# Altium project F4_PCB_Project.PrjPcb
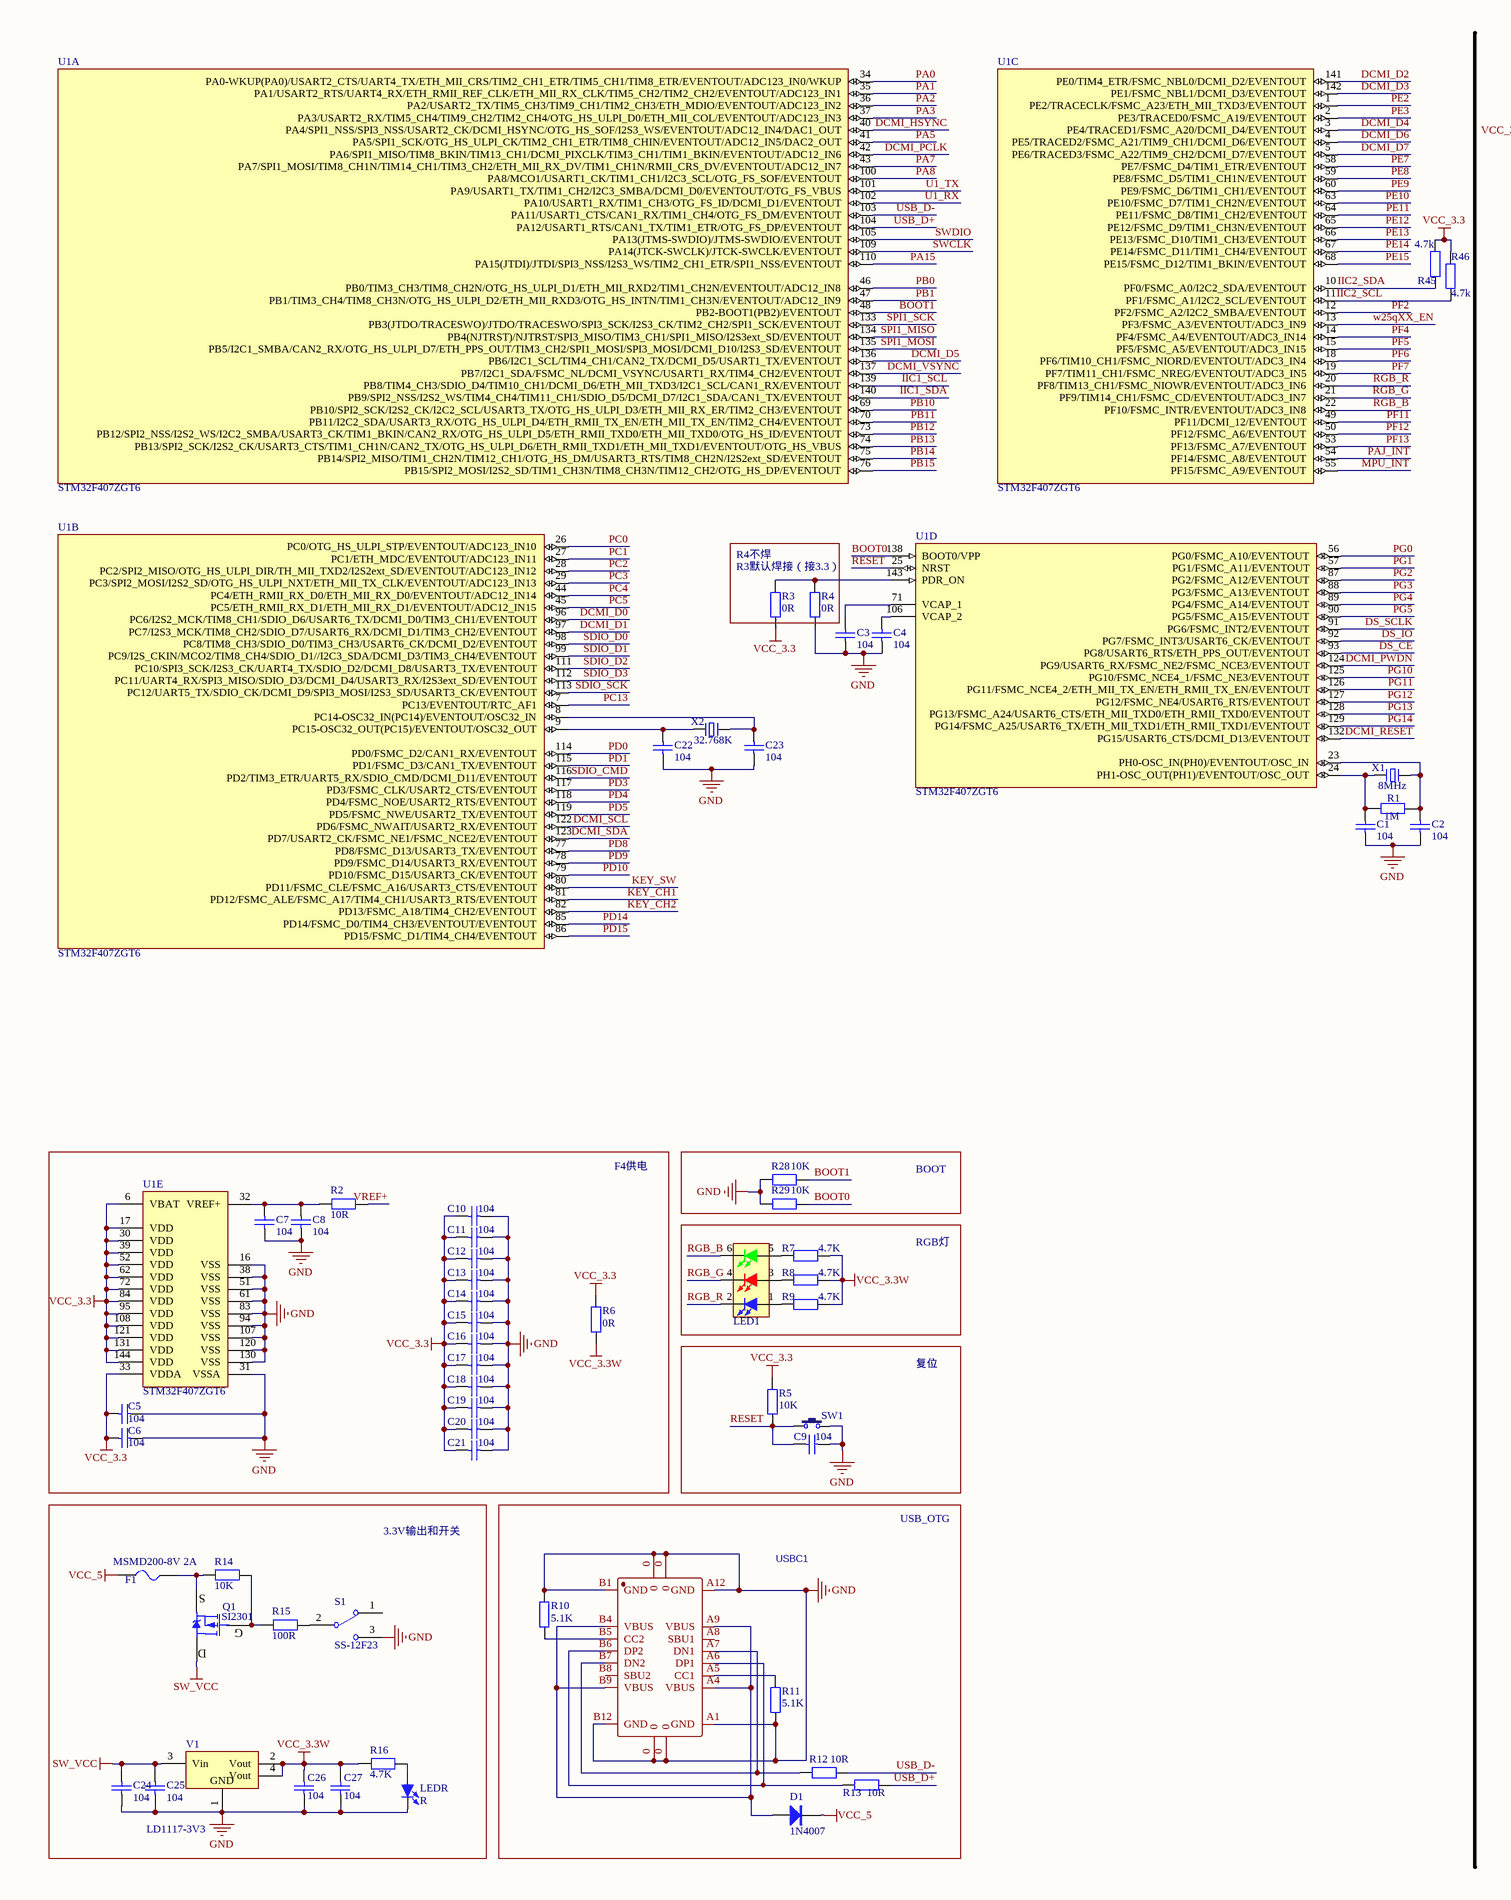
[diagram p0: F4_PCB.SchDoc, left]
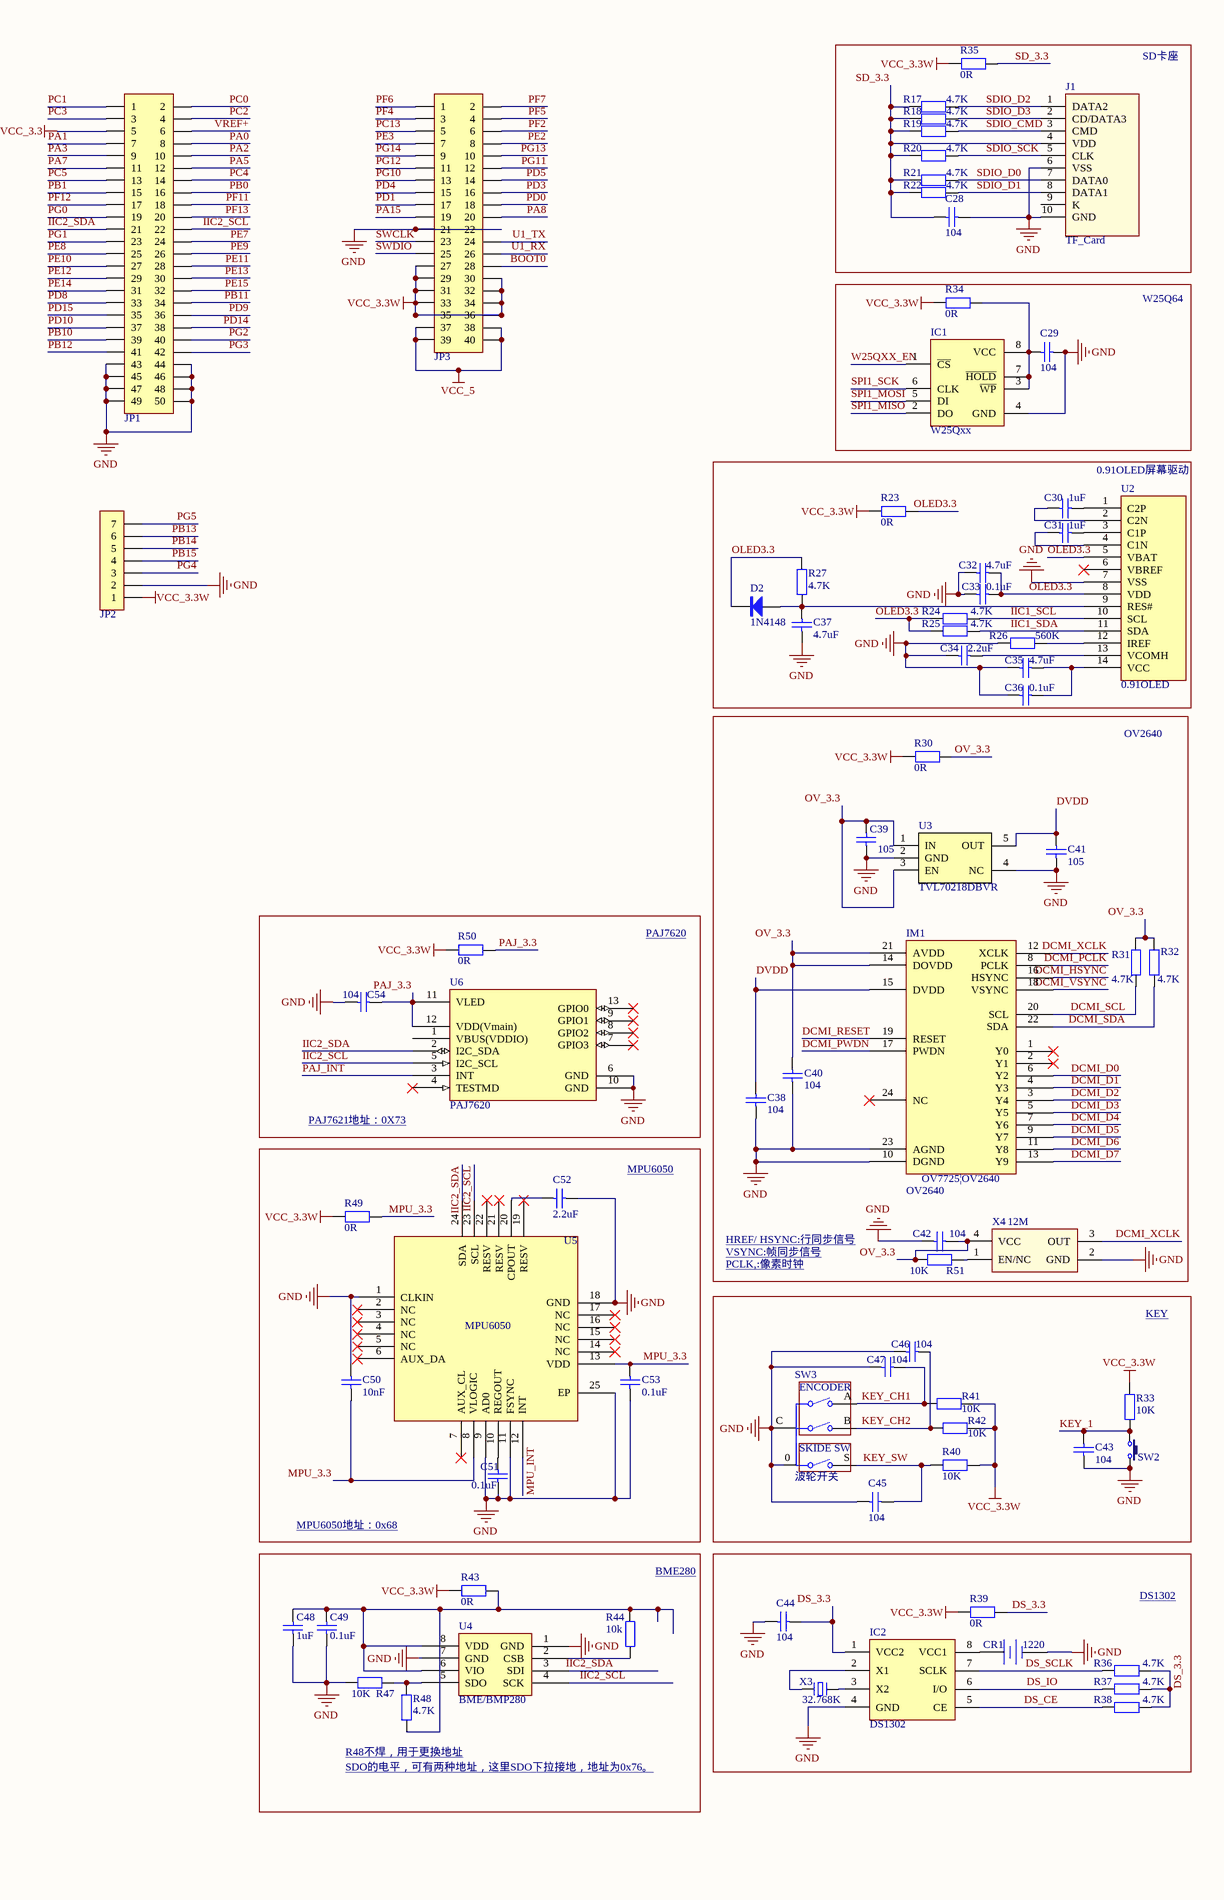
[diagram p1: F4_PCB.SchDoc, right]
1 sheet, 135 parts. Net scope: global (net labels, ports and power ports of the same name join across sheets).
Board file: F4_PCB.PcbDoc

## Sheet F4_PCB.SchDoc
size A2; SheetNumber: 1; SheetTotal: 1

### Parts
C1  104  [C 0603_N]
C2  104  [C 0603_N]
C3  104  [C 0603_N]
C4  104  [C 0603_N]
C5  104  [C 0603_N]
C6  104  [C 0603_N]
C7  104  [C 0603_N]
C8  104  [C 0603_N]
C9  104  [C 0603_N]
C10  104  [C 0603_N]
C11  104  [C 0603_N]
C12  104  [C 0603_N]
C13  104  [C 0603_N]
C14  104  [C 0603_N]
C15  104  [C 0603_N]
C16  104  [C 0603_N]
C17  104  [C 0603_N]
C18  104  [C 0603_N]
C19  104  [C 0603_N]
C20  104  [C 0603_N]
C21  104  [C 0603_N]
C22  104  [C 0603_N]
C23  104  [C 0603_N]
C24  104  [C 0603_N]
C25  104  [C 0603_N]
C26  104  [C 0603_N]
C27  104  [C 0603_N]
C28  104  [C 0603_N]
C29  104  [C 0603_N]
C30  1uF  [C 0603_N]
C31  1uF  [C 0603_N]
C32  4.7uF  [C 0603_N]
C33  0.1uF  [C 0603_N]
C34  2.2uF  [C 0603_N]
C35  4.7uF  [C 0603_N]
C36  0.1uF  [C 0603_N]
C37  4.7uF  [C 0603_N]
C38  104  [C 0603_N]
C39  105  [C 0603_N]
C40  104  [C 0603_N]
C41  105  [C 0603_N]
C42  104  [C 0603_N]
C43  104  [C 0603_N]
C44  104  [C 0603_N]
C45  104  [C 0603_N]
C46  104  [C 0603_N]
C47  104  [C 0603_N]
C48  1uF  [C 0603_N]
C49  0.1uF  [C 0603_N]
C50  10nF  [C 0603_N]
C51  0.1uF  [C 0603_N]
C52  2.2uF  [C 0603_N]
C53  0.1uF  [C 0603_N]
C54  104  [C 0603_N]
CR1  1220  [ML621FE]
D1  1N4007  [DO-41]
D2  1N4148  [SOD-123]
F1  MSMD200-8V 2A  [FU 0805]
IC1  W25Qxx  [SOP8W_L]
IC2  DS1302  [SOP8_L]
IM1  OV2640  [FPC0.5 2H-WS-24P]
J1  TF_Card  [Micro SD]
JP1  Header 2X25  [HDR2.54-LI-2x25P]  (value not drawn)
JP2  HDR-1X7  [HDR2.54-M-LI-7P]  (value not drawn)
JP3  Header 2X11  [HDR2.54-LI-2x20P]  (value not drawn)
LED1  LED-RGB  [LED 5050]  (value not drawn)
LEDR  R  [LED 0603R]
Q1  SI2301  [SOT23-3L]
R1  1M  [R 0603_N]
R2  10R  [R 0603_N]
R3  0R  [R 0603_N]
R4  0R  [R 0603_N]
R5  10K  [R 0603_N]
R6  0R  [R 0603_N]
R7  4.7K  [R 0603_N]
R8  4.7K  [R 0603_N]
R9  4.7K  [R 0603_N]
R10  5.1K  [R 0603_N]
R11  5.1K  [R 0603_N]
R12  10R  [R 0603_N]
R13  10R  [R 0603_N]
R14  10K  [R 0603_N]
R15  100R  [R 0603_N]
R16  4.7K  [R 0603_N]
R17  4.7K  [R 0603_N]
R18  4.7K  [R 0603_N]
R19  4.7K  [R 0603_N]
R20  4.7K  [R 0603_N]
R21  4.7K  [R 0603_N]
R22  4.7K  [R 0603_N]
R23  0R  [R 0603_N]
R24  4.7K  [R 0603_N]
R25  4.7K  [R 0603_N]
R26  560K  [R 0603_N]
R27  4.7K  [R 0603_N]
R28  10K  [R 0603_N]
R29  10K  [R 0603_N]
R30  0R  [R 0603_N]
R31  4.7K  [R 0603_N]
R32  4.7K  [R 0603_N]
R33  10K  [R 0603_N]
R34  0R  [R 0603_N]
R35  0R  [R 0603_N]
R36  4.7K  [R 0603_N]
R37  4.7K  [R 0603_N]
R38  4.7K  [R 0603_N]
R39  0R  [R 0603_N]
R40  10K  [R 0603_N]
R41  10K  [R 0603_N]
R42  10K  [R 0603_N]
R43  0R  [R 0603_N]
R44  10k  [R 0603_N]
R45  4.7k  [R 0603_N]
R46  4.7k  [R 0603_N]
R47  10K  [R 0603_N]
R48  4.7K  [R 0603_N]
R49  0R  [R 0603_N]
R50  0R  [R 0603_N]
R51  10K  [R 0603_N]
S1  SS-12F23  [MSK-12C01-07]
SW1  3x6x5  [TSW 3*6*4.3-S-W]  (value not drawn)
SW2  3x6x5  [TSW 3*6*4.3-S-W]  (value not drawn)
SW3  波轮开关  [SIQ-02FVS3]
U1  STM32F407ZGT6  [TQFP144_N]  (parts A,B,C,D,E of 5)
U2  0.91OLED  [0.91OLED]
U3  TVL70218DBVR  [SOT-23-5]
U4  BME/BMP280  [BME/BMP280]
U5  MPU6050  [MPU6050]
U6  PAJ7620  [PAJ7620]
USBC1  TYPE-C 2.0 -16P  [USB-C-SMD_TYPE-C-USB-5]  (value not drawn)
V1  LD1117-3V3  [SOT223_L]
X1  8MHz  [OSC 5032-2P]
X2  32.768K  [OSC 3215-2P]
X3  32.768K  [OSC 3215-2P]
X4  12M  [OSC 5032-4P]

### Blocks framed on the sheet
SD卡座: C28 J1 R17-R22 R35
W25Q64: C29 IC1 R34
0.91OLED屏幕驱动: C30-C37 D2 R23-R27 U2
F4供电: C5-C8 C10-C21 R2 R6 U1
BOOT: R28 R29
RGB灯: LED1 R7-R9
KEY: C43 C45-C47 R33 R40-R42 SW2 SW3
复位: C9 R5 SW1
3.3V输出和开关: C24-C27 F1 LEDR Q1 R14-R16 S1 V1
USB_OTG: D1 R10-R13 USBC1
DS1302: C44 CR1 IC2 R36-R39 X3

### Nets
GND: C1.2 C2.2 C3.1 C4.1 C5.2 C6.2 C7.1 C8.1 C9.2 C10.1 C11.1 C12.1 C13.1 C14.1 C15.1 C16.1 C17.1 C18.1 C19.1 C20.1 C21.1 C22.1 C23.1 C24.1 C25.1 C26.1 C27.1 C28.2 C29.2 C32.1 C33.1 C34.1 C35.1 C36.1 C37.1 C38.1 C39.1 C40.1 C41.1 C42.1 C43.1 C44.1 C45.1 C46.1 C47.1 C48.1 C49.1 C50.2 C51.1 C52.2 C53.1 C54.1 CR1.2(DC-) IC1.4(GND) IC2.4(GND) IM1.10(DGND) IM1.23(AGND) J1.6(VSS) J1.10(GND) JP1.43 JP1.44 JP1.45 JP1.46 JP1.47 JP1.48 JP1.49 JP1.50 JP2.2 JP3.21 JP3.22 LEDR.2(K) R4.1 R10.2 R11.1 R26.1 R28.1 R29.1 R47.1 S1.3 SW1.2 SW2.2 SW3.0 SW3.C U1.16(VSS) U1.31(VSSA) U1.38(VSS) U1.51(VSS) U1.61(VSS) U1.83(VSS) U1.94(VSS) U1.107(VSS) U1.120(VSS) U1.130(VSS) U2.7(VSS) U3.2(GND) U3.4(NC) U4.1(GND) U4.7(GND) U5.1(CLKIN) U5.9(AD0) U5.11(FSYNC) U5.18(GND) U5.25(EP) U6.6(GND) U6.10(GND) USBC1.0 USBC1.A1(GND) USBC1.A12(GND) USBC1.B1(GND) USBC1.B12(GND) V1.1(GND) X4.2(GND)
SW_VCC: C24.2 C25.2 Q1.3(D) V1.3(Vin)
VCC_3.3: C5.1 C6.1 C10.2 C11.2 C12.2 C13.2 C14.2 C15.2 C16.2 C17.2 C18.2 C19.2 C20.2 C21.2 JP1.5 R3.1 R5.2 R6.2 R45.2 R46.2 U1.6(VBAT) U1.17(VDD) U1.30(VDD) U1.33(VDDA) U1.39(VDD) U1.52(VDD) U1.62(VDD) U1.72(VDD) U1.84(VDD) U1.95(VDD) U1.108(VDD) U1.121(VDD) U1.131(VDD) U1.144(VDD)
VCC_3.3W: C26.2 C27.2 JP2.1 JP3.27 JP3.29 JP3.30 JP3.31 JP3.32 JP3.33 JP3.34 JP3.35 JP3.36 R6.1 R7.2 R8.2 R9.2 R16.1 R23.1 R30.1 R33.2 R34.1 R35.1 R39.1 R40.2 R41.2 R42.2 R43.1 R49.1 R50.1 V1.2(Vout) V1.4(Vout)
VCC_5: D1.2(K) F1.1 JP3.37 JP3.38 JP3.39 JP3.40
BOOT0: JP3.28 R29.2 U1.138(BOOT0/VPP)
BOOT1: R28.2 U1.48(PB2-BOOT1(PB2)/EVENTOUT)
DCMI_D0: IM1.6(Y2) U1.96(PC6/I2S2_MCK/TIM8_CH1/SDIO_D6/USART6_TX/DCMI_D0/TIM3_CH1/EVENTOUT)
DCMI_D1: IM1.4(Y3) U1.97(PC7/I2S3_MCK/TIM8_CH2/SDIO_D7/USART6_RX/DCMI_D1/TIM3_CH2/EVENTOUT)
DCMI_D2: IM1.3(Y4) U1.141(PE0/TIM4_ETR/FSMC_NBL0/DCMI_D2/EVENTOUT)
DCMI_D3: IM1.5(Y5) U1.142(PE1/FSMC_NBL1/DCMI_D3/EVENTOUT)
DCMI_D4: IM1.7(Y6) U1.3(PE4/TRACED1/FSMC_A20/DCMI_D4/EVENTOUT)
DCMI_D5: IM1.9(Y7) U1.136(PB6/I2C1_SCL/TIM4_CH1/CAN2_TX/DCMI_D5/USART1_TX/EVENTOUT)
DCMI_D6: IM1.11(Y8) U1.4(PE5/TRACED2/FSMC_A21/TIM9_CH1/DCMI_D6/EVENTOUT)
DCMI_D7: IM1.13(Y9) U1.5(PE6/TRACED3/FSMC_A22/TIM9_CH2/DCMI_D7/EVENTOUT)
DCMI_HSYNC: IM1.16(HSYNC) U1.40(PA4/SPI1_NSS/SPI3_NSS/USART2_CK/DCMI_HSYNC/OTG_HS_SOF/I2S3_WS/EVENTOUT/ADC12_IN4/DAC1_OUT)
DCMI_PCLK: IM1.8(PCLK) U1.42(PA6/SPI1_MISO/TIM8_BKIN/TIM13_CH1/DCMI_PIXCLK/TIM3_CH1/TIM1_BKIN/EVENTOUT/ADC12_IN6)
DCMI_PWDN: IM1.17(PWDN) U1.124(PG9/USART6_RX/FSMC_NE2/FSMC_NCE3/EVENTOUT)
DCMI_RESET: IM1.19(RESET) U1.132(PG15/USART6_CTS/DCMI_D13/EVENTOUT)
DCMI_SCL: IM1.20(SCL) R31.1 U1.122(PD6/FSMC_NWAIT/USART2_RX/EVENTOUT)
DCMI_SDA: IM1.22(SDA) R32.1 U1.123(PD7/USART2_CK/FSMC_NE1/FSMC_NCE2/EVENTOUT)
DCMI_VSYNC: IM1.18(VSYNC) U1.137(PB7/I2C1_SDA/FSMC_NL/DCMI_VSYNC/USART1_RX/TIM4_CH2/EVENTOUT)
DCMI_XCLK: IM1.12(XCLK) X4.3(OUT)
DS_3.3: C44.2 IC2.1(VCC2) R36.2 R37.2 R38.2 R39.2
DS_CE: IC2.5(CE) R38.1 U1.93(PG8/USART6_RTS/ETH_PPS_OUT/EVENTOUT)
DS_IO: IC2.6(I/O) R37.1 U1.92(PG7/FSMC_INT3/USART6_CK/EVENTOUT)
DS_SCLK: IC2.7(SCLK) R36.1 U1.91(PG6/FSMC_INT2/EVENTOUT)
DVDD: C38.2 C41.2 IM1.15(DVDD) U3.5(OUT)
IIC1_SCL: R24.2 U1.139(PB8/TIM4_CH3/SDIO_D4/TIM10_CH1/DCMI_D6/ETH_MII_TXD3/I2C1_SCL/CAN1_RX/EVENTOUT) U2.10(SCL)
IIC1_SDA: R25.2 U1.140(PB9/SPI2_NSS/I2S2_WS/TIM4_CH4/TIM11_CH1/SDIO_D5/DCMI_D7/I2C1_SDA/CAN1_TX/EVENTOUT) U2.11(SDA)
IIC2_SCL: JP1.22 R46.1 U1.11(PF1/FSMC_A1/I2C2_SCL/EVENTOUT) U4.4(SCK) U5.23(SCL) U6.5(I2C_SCL)
IIC2_SDA: JP1.21 R45.1 U1.10(PF0/FSMC_A0/I2C2_SDA/EVENTOUT) U4.3(SDI) U5.24(SDA) U6.2(I2C_SDA)
KEY_1: C43.2 R33.1 SW2.1
KEY_CH1: C47.2 R41.1 SW3.A U1.81(PD12/FSMC_ALE/FSMC_A17/TIM4_CH1/USART3_RTS/EVENTOUT)
KEY_CH2: C46.2 R42.1 SW3.B U1.82(PD13/FSMC_A18/TIM4_CH2/EVENTOUT)
KEY_SW: C45.2 R40.1 SW3.S U1.80(PD11/FSMC_CLE/FSMC_A16/USART3_CTS/EVENTOUT)
MPU_3.3: C50.1 C53.2 R49.2 U5.8(VLOGIC) U5.13(VDD)
MPU_INT: U1.55(PF15/FSMC_A9/EVENTOUT) U5.12(INT)
OLED3.3: C32.2 C33.2 D2.2(K) R23.2 R24.1 R25.1 R27.2 U2.5(VBAT) U2.8(VDD)
OV_3.3: C39.2 C40.2 C42.2 IM1.14(DOVDD) IM1.21(AVDD) R30.2 R31.2 R32.2 R51.1 U3.1(IN) U3.3(EN) X4.4(VCC)
PA0: JP1.8 U1.34(PA0-WKUP(PA0)/USART2_CTS/UART4_TX/ETH_MII_CRS/TIM2_CH1_ETR/TIM5_CH1/TIM8_ETR/EVENTOUT/ADC123_IN0/WKUP)
PA1: JP1.7 U1.35(PA1/USART2_RTS/UART4_RX/ETH_RMII_REF_CLK/ETH_MII_RX_CLK/TIM5_CH2/TIM2_CH2/EVENTOUT/ADC123_IN1)
PA2: JP1.10 U1.36(PA2/USART2_TX/TIM5_CH3/TIM9_CH1/TIM2_CH3/ETH_MDIO/EVENTOUT/ADC123_IN2)
PA3: JP1.9 U1.37(PA3/USART2_RX/TIM5_CH4/TIM9_CH2/TIM2_CH4/OTG_HS_ULPI_D0/ETH_MII_COL/EVENTOUT/ADC123_IN3)
PA5: JP1.12 U1.41(PA5/SPI1_SCK/OTG_HS_ULPI_CK/TIM2_CH1_ETR/TIM8_CHIN/EVENTOUT/ADC12_IN5/DAC2_OUT)
PA7: JP1.11 U1.43(PA7/SPI1_MOSI/TIM8_CH1N/TIM14_CH1/TIM3_CH2/ETH_MII_RX_DV/TIM1_CH1N/RMII_CRS_DV/EVENTOUT/ADC12_IN7)
PA8: JP3.20 U1.100(PA8/MCO1/USART1_CK/TIM1_CH1/I2C3_SCL/OTG_FS_SOF/EVENTOUT)
PA15: JP3.19 U1.110(PA15(JTDI)/JTDI/SPI3_NSS/I2S3_WS/TIM2_CH1_ETR/SPI1_NSS/EVENTOUT)
PAJ_3.3: C54.2 R50.2 U6.11(VLED) U6.12(VDD(Vmain))
PAJ_INT: U1.54(PF14/FSMC_A8/EVENTOUT) U6.3(INT)
PB0: JP1.16 U1.46(PB0/TIM3_CH3/TIM8_CH2N/OTG_HS_ULPI_D1/ETH_MII_RXD2/TIM1_CH2N/EVENTOUT/ADC12_IN8)
PB1: JP1.15 U1.47(PB1/TIM3_CH4/TIM8_CH3N/OTG_HS_ULPI_D2/ETH_MII_RXD3/OTG_HS_INTN/TIM1_CH3N/EVENTOUT/ADC12_IN9)
PB10: JP1.39 U1.69(PB10/SPI2_SCK/I2S2_CK/I2C2_SCL/USART3_TX/OTG_HS_ULPI_D3/ETH_MII_RX_ER/TIM2_CH3/EVENTOUT)
PB11: JP1.34 U1.70(PB11/I2C2_SDA/USART3_RX/OTG_HS_ULPI_D4/ETH_RMII_TX_EN/ETH_MII_TX_EN/TIM2_CH4/EVENTOUT)
PB12: JP1.41 U1.73(PB12/SPI2_NSS/I2S2_WS/I2C2_SMBA/USART3_CK/TIM1_BKIN/CAN2_RX/OTG_HS_ULPI_D5/ETH_RMII_TXD0/ETH_MII_TXD0/OTG_HS_ID/EVENTOUT)
PB13: JP2.6 U1.74(PB13/SPI2_SCK/I2S2_CK/USART3_CTS/TIM1_CH1N/CAN2_TX/OTG_HS_ULPI_D6/ETH_RMII_TXD1/ETH_MII_TXD1/EVENTOUT/OTG_HS_VBUS)
PB14: JP2.5 U1.75(PB14/SPI2_MISO/TIM1_CH2N/TIM12_CH1/OTG_HS_DM/USART3_RTS/TIM8_CH2N/I2S2ext_SD/EVENTOUT)
PB15: JP2.4 U1.76(PB15/SPI2_MOSI/I2S2_SD/TIM1_CH3N/TIM8_CH3N/TIM12_CH2/OTG_HS_DP/EVENTOUT)
PC0: JP1.2 U1.26(PC0/OTG_HS_ULPI_STP/EVENTOUT/ADC123_IN10)
PC1: JP1.1 U1.27(PC1/ETH_MDC/EVENTOUT/ADC123_IN11)
PC2: JP1.4 U1.28(PC2/SPI2_MISO/OTG_HS_ULPI_DIR/TH_MII_TXD2/I2S2ext_SD/EVENTOUT/ADC123_IN12)
PC3: JP1.3 U1.29(PC3/SPI2_MOSI/I2S2_SD/OTG_HS_ULPI_NXT/ETH_MII_TX_CLK/EVENTOUT/ADC123_IN13)
PC4: JP1.14 U1.44(PC4/ETH_RMII_RX_D0/ETH_MII_RX_D0/EVENTOUT/ADC12_IN14)
PC5: JP1.13 U1.45(PC5/ETH_RMII_RX_D1/ETH_MII_RX_D1/EVENTOUT/ADC12_IN15)
PC13: JP3.5 U1.7(PC13/EVENTOUT/RTC_AF1)
PD0: JP3.18 U1.114(PD0/FSMC_D2/CAN1_RX/EVENTOUT)
PD1: JP3.17 U1.115(PD1/FSMC_D3/CAN1_TX/EVENTOUT)
PD3: JP3.16 U1.117(PD3/FSMC_CLK/USART2_CTS/EVENTOUT)
PD4: JP3.15 U1.118(PD4/FSMC_NOE/USART2_RTS/EVENTOUT)
PD5: JP3.14 U1.119(PD5/FSMC_NWE/USART2_TX/EVENTOUT)
PD8: JP1.33 U1.77(PD8/FSMC_D13/USART3_TX/EVENTOUT)
PD9: JP1.36 U1.78(PD9/FSMC_D14/USART3_RX/EVENTOUT)
PD10: JP1.37 U1.79(PD10/FSMC_D15/USART3_CK/EVENTOUT)
PD14: JP1.38 U1.85(PD14/FSMC_D0/TIM4_CH3/EVENTOUT/EVENTOUT)
PD15: JP1.35 U1.86(PD15/FSMC_D1/TIM4_CH4/EVENTOUT)
PE2: JP3.8 U1.1(PE2/TRACECLK/FSMC_A23/ETH_MII_TXD3/EVENTOUT)
PE3: JP3.7 U1.2(PE3/TRACED0/FSMC_A19/EVENTOUT)
PE7: JP1.24 U1.58(PE7/FSMC_D4/TIM1_ETR/EVENTOUT)
PE8: JP1.25 U1.59(PE8/FSMC_D5/TIM1_CH1N/EVENTOUT)
PE9: JP1.26 U1.60(PE9/FSMC_D6/TIM1_CH1/EVENTOUT)
PE10: JP1.27 U1.63(PE10/FSMC_D7/TIM1_CH2N/EVENTOUT)
PE11: JP1.28 U1.64(PE11/FSMC_D8/TIM1_CH2/EVENTOUT)
PE12: JP1.29 U1.65(PE12/FSMC_D9/TIM1_CH3N/EVENTOUT)
PE13: JP1.30 U1.66(PE13/FSMC_D10/TIM1_CH3/EVENTOUT)
PE14: JP1.31 U1.67(PE14/FSMC_D11/TIM1_CH4/EVENTOUT)
PE15: JP1.32 U1.68(PE15/FSMC_D12/TIM1_BKIN/EVENTOUT)
PF2: JP3.6 U1.12(PF2/FSMC_A2/I2C2_SMBA/EVENTOUT)
PF4: JP3.3 U1.14(PF4/FSMC_A4/EVENTOUT/ADC3_IN14)
PF5: JP3.4 U1.15(PF5/FSMC_A5/EVENTOUT/ADC3_IN15)
PF6: JP3.1 U1.18(PF6/TIM10_CH1/FSMC_NIORD/EVENTOUT/ADC3_IN4)
PF7: JP3.2 U1.19(PF7/TIM11_CH1/FSMC_NREG/EVENTOUT/ADC3_IN5)
PF11: JP1.18 U1.49(PF11/DCMI_12/EVENTOUT)
PF12: JP1.17 U1.50(PF12/FSMC_A6/EVENTOUT)
PF13: JP1.20 U1.53(PF13/FSMC_A7/EVENTOUT)
PG0: JP1.19 U1.56(PG0/FSMC_A10/EVENTOUT)
PG1: JP1.23 U1.57(PG1/FSMC_A11/EVENTOUT)
PG2: JP1.40 U1.87(PG2/FSMC_A12/EVENTOUT)
PG3: JP1.42 U1.88(PG3/FSMC_A13/EVENTOUT)
PG4: JP2.3 U1.89(PG4/FSMC_A14/EVENTOUT)
PG5: JP2.7 U1.90(PG5/FSMC_A15/EVENTOUT)
PG10: JP3.13 U1.125(PG10/FSMC_NCE4_1/FSMC_NE3/EVENTOUT)
PG11: JP3.12 U1.126(PG11/FSMC_NCE4_2/ETH_MII_TX_EN/ETH_RMII_TX_EN/EVENTOUT)
PG12: JP3.11 U1.127(PG12/FSMC_NE4/USART6_RTS/EVENTOUT)
PG13: JP3.10 U1.128(PG13/FSMC_A24/USART6_CTS/ETH_MII_TXD0/ETH_RMII_TXD0/EVENTOUT)
PG14: JP3.9 U1.129(PG14/FSMC_A25/USART6_TX/ETH_MII_TXD1/ETH_RMII_TXD1/EVENTOUT)
RESET: C9.1 R5.1 SW1.1 U1.25(NRST)
RGB_B: LED1.6(GREEN_K) U1.22(PF10/FSMC_INTR/EVENTOUT/ADC3_IN8)
RGB_G: LED1.4(RED_K) U1.21(PF9/TIM14_CH1/FSMC_CD/EVENTOUT/ADC3_IN7)
RGB_R: LED1.2(BULE_K) U1.20(PF8/TIM13_CH1/FSMC_NIOWR/EVENTOUT/ADC3_IN6)
SD_3.3: C28.1 J1.4(VDD) R17.1 R18.1 R19.1 R20.1 R21.1 R22.1 R35.2
SDIO_CMD: J1.3(CMD) R19.2 U1.116(PD2/TIM3_ETR/UART5_RX/SDIO_CMD/DCMI_D11/EVENTOUT)
SDIO_D0: J1.7(DATA0) R21.2 U1.98(PC8/TIM8_CH3/SDIO_D0/TIM3_CH3/USART6_CK/DCMI_D2/EVENTOUT)
SDIO_D1: J1.8(DATA1) R22.2 U1.99(PC9/I2S_CKIN/MCO2/TIM8_CH4/SDIO_D1//I2C3_SDA/DCMI_D3/TIM3_CH4/EVENTOUT)
SDIO_D2: J1.1(DATA2) R17.2 U1.111(PC10/SPI3_SCK/I2S3_CK/UART4_TX/SDIO_D2/DCMI_D8/USART3_TX/EVENTOUT)
SDIO_D3: J1.2(CD/DATA3) R18.2 U1.112(PC11/UART4_RX/SPI3_MISO/SDIO_D3/DCMI_D4/USART3_RX/I2S3ext_SD/EVENTOUT)
SDIO_SCK: J1.5(CLK) R20.2 U1.113(PC12/UART5_TX/SDIO_CK/DCMI_D9/SPI3_MOSI/I2S3_SD/USART3_CK/EVENTOUT)
SPI1_MISO: IC1.2(DO) U1.134(PB4(NJTRST)/NJTRST/SPI3_MISO/TIM3_CH1/SPI1_MISO/I2S3ext_SD/EVENTOUT)
SPI1_MOSI: IC1.5(DI) U1.135(PB5/I2C1_SMBA/CAN2_RX/OTG_HS_ULPI_D7/ETH_PPS_OUT/TIM3_CH2/SPI1_MOSI/SPI3_MOSI/DCMI_D10/I2S3_SD/EVENTOUT)
SPI1_SCK: IC1.6(CLK) U1.133(PB3(JTDO/TRACESWO)/JTDO/TRACESWO/SPI3_SCK/I2S3_CK/TIM2_CH2/SPI1_SCK/EVENTOUT)
SWCLK: JP3.23 U1.109(PA14(JTCK-SWCLK)/JTCK-SWCLK/EVENTOUT)
SWDIO: JP3.25 U1.105(PA13(JTMS-SWDIO)/JTMS-SWDIO/EVENTOUT)
U1_RX: JP3.26 U1.102(PA10/USART1_RX/TIM1_CH3/OTG_FS_ID/DCMI_D1/EVENTOUT)
U1_TX: JP3.24 U1.101(PA9/USART1_TX/TIM1_CH2/I2C3_SMBA/DCMI_D0/EVENTOUT/OTG_FS_VBUS)
USB_D+: R13.2 U1.104(PA12/USART1_RTS/CAN1_TX/TIM1_ETR/OTG_FS_DP/EVENTOUT)
USB_D-: R12.2 U1.103(PA11/USART1_CTS/CAN1_RX/TIM1_CH4/OTG_FS_DM/EVENTOUT)
VREF+: JP1.6 R2.2
W25QXX_EN: IC1.1(~{CS}) U1.13(PF3/FSMC_A3/EVENTOUT/ADC3_IN9)
NetC1_1: C1.1 R1.1 U1.24(PH1-OSC_OUT(PH1)/EVENTOUT/OSC_OUT) X1.2
NetC2_1: C2.1 R1.2 U1.23(PH0-OSC_IN(PH0)/EVENTOUT/OSC_IN) X1.1
NetC3_2: C3.2 U1.71(VCAP_1)
NetC4_2: C4.2 U1.106(VCAP_2)
NetC7_2: C7.2 C8.2 R2.1 U1.32(VREF+)
NetC22_2: C22.2 U1.9(PC15-OSC32_OUT(PC15)/EVENTOUT/OSC32_OUT) X2.1
NetC23_2: C23.2 U1.8(PC14-OSC32_IN(PC14)/EVENTOUT/OSC32_IN) X2.2
NetC29_1: C29.1 IC1.3(~{WP}) IC1.7(~{HOLD}) IC1.8(VCC) R34.2
NetC30_1: C30.1 U2.2(C2N)
NetC30_2: C30.2 U2.1(C2P)
NetC31_1: C31.1 U2.4(C1N)
NetC31_2: C31.2 U2.3(C1P)
NetC34_2: C34.2 U2.13(VCOMH)
NetC35_2: C35.2 C36.2 U2.14(VCC)
NetC37_2: C37.2 D2.1(A) R27.1 U2.9(RES#)
NetC48_2: C48.2 C49.2 R43.2 R44.2 R48.1 U4.6(VIO) U4.8(VDD)
NetC51_2: C51.2 U5.10(REGOUT)
NetC52_1: C52.1 U5.20(CPOUT)
NetCR1_1: CR1.1(DC+) IC2.8(VCC1)
NetD1_1: D1.1(A) USBC1.A4(VBUS) USBC1.A9(VBUS) USBC1.B4(VBUS) USBC1.B9(VBUS)
NetF1_2: F1.2 Q1.2(S) R14.1
NetIC2_2: IC2.2(X1) X3.1
NetIC2_3: IC2.3(X2) X3.2
NetLED1_1: LED1.1(BULE_A) R9.1
NetLED1_3: LED1.3(RED_A) R8.1
NetLED1_5: LED1.5(GREEN_A) R7.1
NetLEDR_1: LEDR.1(A) R16.2
NetQ1_1: Q1.1(G) R14.2 R15.1
NetR3_2: R3.2 R4.2 U1.143(PDR_ON)
NetR10_1: R10.1 USBC1.B5(CC2)
NetR11_2: R11.2 USBC1.A5(CC1)
NetR12_1: R12.1 USBC1.A7(DN1) USBC1.B7(DN2)
NetR13_1: R13.1 USBC1.A6(DP1) USBC1.B6(DP2)
NetR15_2: R15.2 S1.2
NetR26_2: R26.2 U2.12(IREF)
NetR44_1: R44.1 U4.2(CSB)
NetR47_2: R47.2 R48.2 U4.5(SDO)
NetR51_2: R51.2 X4.1(EN/NC)

Not connected (* = marked no-connect by the designer): IM1 1(Y0)* 2(Y1)* 24(NC)*; J1 9(K); S1 1; U2 6(VBREF)*; U5 2(NC)* 3(NC)* 4(NC)* 5(NC)* 6(AUX_DA)* 7(AUX_CL)* 14(NC)* 15(NC)* 16(NC)* 17(NC)* 19(RESV)* 21(RESV)* 22(RESV)*; U6 1(VBUS(VDDIO)) 4(TESTMD)* 7(GPIO3)* 8(GPIO2)* 9(GPIO1)* 13(GPIO0)*; USBC1 A8(SBU1) B8(SBU2)

### Notes on the sheet
- R3默认焊接（接3.3）
- (near R3) R4不焊
- OV2640
- PAJ7620
- PAJ7621地址：0X73
- MPU6050
- HREF/ HSYNC:行同步信号
- VSYNC:帧同步信号
- PCLK,:像素时钟
- MPU6050地址：0x68
- BME280
- (near R48) R48不焊，用于更换地址
- (near R48) SDO的电平，可有两种地址，这里SDO下拉接地，地址为0x76。
- (in symbol OV2640) OV7725|OV2640
- (in symbol 波轮开关) ENCODER; SKIDE SW

### Library data of the parts
C1-C54 = C: 贴片电容; BOM名称: 无极性贴片电容; 联系卖家，免费查找封装: 唯一出售店铺网址https://shop463601444.taobao.com; 封装库来自淘宝卖家ID：黄晶宝石: 其他店铺购入均为盗版假冒封装库
CR1 = CR-3V: 微型电池; 联系卖家，免费查找封装: 唯一出售店铺网址https://shop463601444.taobao.com; BOM名称: 微型电池
D1 = 1N4007: 整流二极管; 联系卖家，免费查找封装: 唯一出售店铺网址https://shop463601444.taobao.com; BOM名称: 整流二极管
D2 = 1N4148: 开关二极管; BOM名称: 高速开关二极管; 联系卖家，免费查找封装: 唯一出售店铺网址https://shop463601444.taobao.com
F1 = FU: 贴片保险丝; 联系卖家，免费查找封装: 唯一出售店铺网址https://shop463601444.taobao.com; BOM名称: 贴片保险丝
IC1 = W25Q: SPI Flash; BOM名称: 外置Flash; 联系卖家，免费查找封装: 唯一出售店铺网址https://shop463601444.taobao.com
IC2 = DS1302: 实时时钟芯片; 联系卖家，免费查找封装: 唯一出售店铺网址https://shop463601444.taobao.com; BOM名称: 实时时钟芯片
J1 = TF_Card: TF卡座; 联系卖家，免费技术支持: 唯一出售店铺网址https://shop463601444.taobao.com; BOM名称: TF卡座
JP1 = Header 25X2: 25*2P接插件; BOM名称: 20*2P接插件; 封装库来自淘宝卖家 ID：黄晶宝石: 其他店铺购入均为盗版假冒封装库; 联系卖家，免费查找封装: 唯一出售店铺网址https://shop463601444.taobao.com
JP2 = Header 7: 7P接插件; 封装库来自淘宝卖家 ID：黄晶宝石: 其他店铺购入均为盗版假冒封装库; 联系卖家，免费查找封装: 唯一出售店铺网址https://shop463601444.taobao.com; BOM名称: 7P接插件
JP3 = Header 20X2: 20*2P接插件; 封装库来自淘宝卖家 ID：黄晶宝石: 其他店铺购入均为盗版假冒封装库; 联系卖家，免费查找封装: 唯一出售店铺网址https://shop463601444.taobao.com; BOM名称: 20*2P接插件
LED1 = LED-RGB 5050: 5050三基色LED; BOM名称: 三基色LED; 封装库来自淘宝卖家 ID：黄晶宝石: 其他店铺购入均为假冒，请立即申请退款，本店奖励2~5元现金
LEDR = LED-SMD: 贴片LED; 封装库来自淘宝卖家 ID：黄晶宝石: 其他店铺购入均为假冒，请立即申请退款，本店奖励2~5元现金; BOM名称: 贴片LED
Q1 = SI2301: P沟道场效应管; 联系卖家，免费查找封装: 唯一出售店铺网址https://shop463601444.taobao.com; BOM名称: P沟道场效应管
R1-R51 = R: 贴片电阻; 联系卖家，免费查找封装: 唯一出售店铺网址https://shop463601444.taobao.com; 封装库来自淘宝卖家ID：黄晶宝石: 其他店铺购入均为盗版假冒封装库; BOM名称: 贴片电阻
S1 = SSW-1P: 1路波动开关; BOM名称: 波动开关; 联系卖家，免费查找封装: 唯一出售店铺网址https://shop463601444.taobao.com
SW1 SW2 = TSW 3x6: 3x6轻触开关; 联系卖家，免费查找封装: 唯一出售店铺网址https://shop463601444.taobao.com; BOM名称: 3x6轻触开关
U1 = STM32F407ZGT6: ARM Cortex-M4 32b MCU+FPU, 210DMIP, 1024 kB Flash, 192+4 kB RAM, Camera, 114 I/Os, 144-pin LQFP, -40 to +85癈, Tray; Internal RAM: 192kB; Operating Frequency (Processor Speed): 168MHz; A/D Converter: 24x12-bit; D/A Converter: 2x12-bit; 16-bit Timers (IC/OC/PWM): 12x16-bit(24/24/30); 32-bit Timer (IC/OC/PWM): 2x32-bit (8/8/8); Other Timer Functions: 2xWDG, RTC, 24-bit down counter; Serial Interface: 3xSPI/2xI2S/2xI2C/3xUSART(IrDa, ISO7816)/3xUART/2xUSB OTG FS/HS, 2xCAN/Ethernet MAC10/100, SDIO; 联系卖家，免费查找封装: 唯一出售店铺网址https://shop463601444.taobao.com; DatasheetVersion: rev2, Jan-2012; PackageVersion: 2012; PackageReference: TQFP144; PackageDescription: 144-Pin Low Profile Quad Flat Package, 20x20 mm Body, 0.5 mm Pitch; ComponentLink1Description: Manufacturer URL; ComponentLink1URL: http://www.st.com/; ComponentLink2Description: STM32F405/7 Datasheet; ComponentLink2URL: http://www.st.com/internet/com/TECHNICAL_RESOURCES/TECHNICAL_LITERATURE/DATASHEET/DM00037051.pdf; ComponentLink3Description: STM32F4 Web Page; ComponentLink3URL: http://www.st.com/internet/mcu/subclass/1521.jsp
U3 = TVL70218DBVR: TI LDO
USBC1 = USB2.0 Type-C 16Pin母座: USB2.0 Type-C 母座 16Pin; 联系卖家，免费技术支持: 唯一出售店铺网址https://shop463601444.taobao.com
V1 = LD1117: 三端稳压芯片; BOM名称: 稳压芯片; 封装库来自淘宝卖家 ID：黄晶宝石: 其他店铺购入均为假冒，请立即申请退款，本店奖励2~5元现金
X1-X3 = XTAL-2P: 2脚无源脚晶振; 联系卖家，免费查找封装: 唯一出售店铺网址https://shop463601444.taobao.com; BOM名称: 2脚无源脚晶振
X4 = XTAL-ACT-4P: 4脚有源晶振; 联系卖家，免费查找封装: 唯一出售店铺网址https://shop463601444.taobao.com; BOM名称: 4脚有源晶振